# EAGLE design INMP441MEMSMicrophone.v04x (EAGLE 7.2.0)
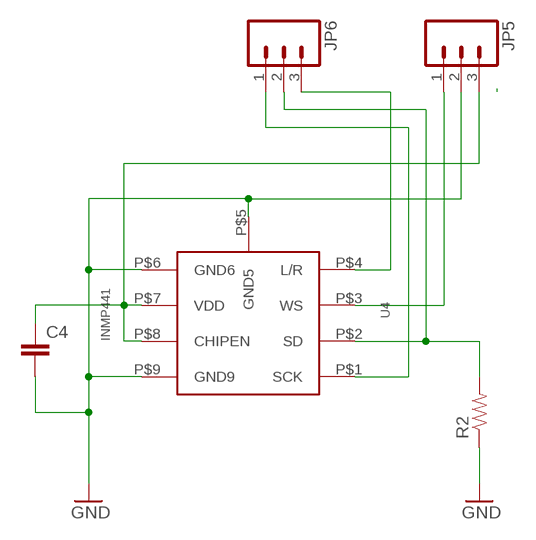
[diagram p0: schematic, sheet 1]

## Parts
C4  CAP0402-CAP  [0402-CAP]
JP5  M031X03_NO_SILK  [1X03_NO_SILK]
JP6  M031X03_NO_SILK  [1X03_NO_SILK]
R2  RESISTOR0402-RES  [0402-RES]
U4  INMP441  [INMP441]

## Nets
GND: C4.2 JP5.2 R2.1 U4.P$5(GND5) U4.P$6(GND6) U4.P$9(GND9)
N$1: JP6.3 U4.P$4(L/R)
N$3: JP5.1 U4.P$3(WS)
N$4: JP6.2 R2.2 U4.P$2(SD)
N$5: JP6.1 U4.P$1(SCK)
N$12: C4.1 JP5.3 U4.P$7(VDD) U4.P$8(CHIPEN)

## Library data of the parts
C4 = SparkFun-Capacitors:CAP: Capacitor Standard 0603 ceramic capacitor, and 0.1" leaded capacitor.
JP5 JP6 = SparkFun-Connectors:M03: Header 3 Standard 3-pin 0.1" header. Use with straight break away headers (SKU : PRT-00116), right angle break away headers (PRT-00553), swiss pins (PRT-00743), machine pins (PRT-00117), and female headers (PRT-00115). Molex polarized connector foot print use with SKU : PRT-08232 with associated crimp pins and housings.
R2 = SparkFun-Passives:RESISTOR: Resistor Basic schematic elements and footprints for 0603, 1206, and PTH resistors.
U4 = INMP441MEMSMicrophone.v01x:INMP441: INMP441 Invensense MEMS microphone

## Board
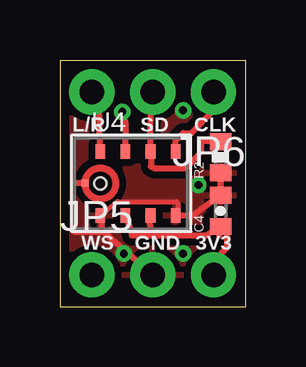
[diagram p1: board, top side]
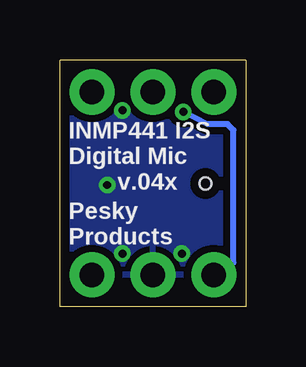
[diagram p2: board, bottom side, seen from below]

Size 7.75 x 10.29 mm. Coordinates in mm from the lower left corner, seen from the top.
Outline: 7.75,0 7.75,10.29 0,10.29 0,0 7.75,0
Copper layers (1*16): Top 0.0356mm / dielectric 1.5011mm / Bottom 0.0356mm
Design rules "OSHPark *": minimum track width 6mil, minimum drill 13mil, track to track 6mil, track to pad 6mil, pad to pad 6mil, via to via 6mil, smd to smd 6mil, copper to edge 15mil, drill to drill 6mil, minimum pad ring 7mil, minimum via ring 7mil, stop-mask expansion 3mil, vias tented up to drill 20mil, thermal gap 10mil

### Footprints (pad centres in the part's own frame; a part is rotated, then mirrored left to right if it is on the bottom)
0402-CAP = smd 0.7 x 0.9: 1 -0.65,0; 2 0.65,0
1X03_NO_SILK = drill 1.016 pad 1.88: 1 0,0; 2 2.54,0; 3 5.08,0
0402-RES = smd 0.7 x 0.9: 1 -0.65,0; 2 0.65,0
INMP441 = smd 0.4 x 0.6: P$1 1.86,1.33; P$2 0.81,1.33; P$3 -0.24,1.33; P$4 -1.29,1.33; P$6 -1.29,-1.33; P$7 -0.24,-1.33; P$8 0.81,-1.33; P$9 1.86,-1.33 | smd 0.3 x 0.3: P$5 -1.92,0.015 | hole 0.5: -1.29,0

### Placement (x,y rotation side)
C4  6.71,4 90 top
JP5  1.33,1.33 0 top
JP6  6.41,8.95 180 top
R2  6.71,6.24 90 top
U4  2.97,5.14 0 top

### Tracks (layer width: path | path; a pad name or v marks a point on that pad's centre or on a via)
GND  (via drill 0.33)
  Top 0.152: 1.75,3.8 1.73,3.87 | 4.93,3.83 U4.P$9
  Top 0.203: 1.73,3.87 2.4,4.38 4.88,4.38 4.93,4.3 4.93,3.83
  Top 0.254: U4.P$5 0.56,5.16 0.56,3.19 0.61,3.14 1.78,3.14 | 1.78,3.14 1.82,3.14 JP5.2 | 1.75,3.79 U4.P$6 1.75,3.8 | U4.P$9 4.92,3.8 5.52,3.8 C4.2 R2.1 | 1.73,3.87 1.73,3.28 1.78,3.14
  other vias: 2.67,2.22 5.78,5.08 5.14,2.22 5.14,8.19
  pour Top (isolate 0.305): -0.13,7.81 -0.08,2.48 -0.13,2.57 -0.15,-0.09 7.89,-0.1 7.87,10.34 -0.2,10.27 -0.17,7.8
  pour Bottom (isolate 0.305): -0.13,7.81 -0.1,2.48 -0.13,2.55 -0.13,-0.14 7.85,-0.04 7.87,10.34 -0.13,10.27 -0.15,7.8
N$1
  Top 0.254: 1.78,6.54 1.78,6.47 U4.P$4 1.64,8.52 JP6.3
N$3  (via drill 0.33)
  Top 0.254: U4.P$3 2.75,7.64 v2.6,8.13
  Bottom 0.254: JP5.1 0.51,1.84 0.51,7.37 0.76,7.62 1.59,7.62 v2.6,8.13
N$4
  Top 0.254: U4.P$2 3.87,6.31 | U4.P$2 3.8,8.88 JP6.2 | U4.P$2 3.8,5.85 3.94,5.78 5.27,5.78 5.91,6.48 5.91,6.86 6.03,6.92 6.95,6.92 R2.2
N$5
  Top 0.254: U4.P$1 4.83,6.93 5.14,7.24 5.46,7.24 6.48,8.26 6.48,8.89 JP6.1
N$12
  Top 0.254: U4.P$8 3.74,3.55 3.86,2.98 | U4.P$7 3,2.98 3.86,2.98 | 6.66,2.98 C4.1 | 3.86,2.98 6.1,2.98 C4.1 | JP5.3 6.41,1.91 6.99,2.48 6.99,3.19 C4.1

### Text on the board
tPlace: L/R | SD | CLK | WS | GND | 3V3
bPlace: v.04x | INMP441 I2S / Digital Mic | Pesky / Products